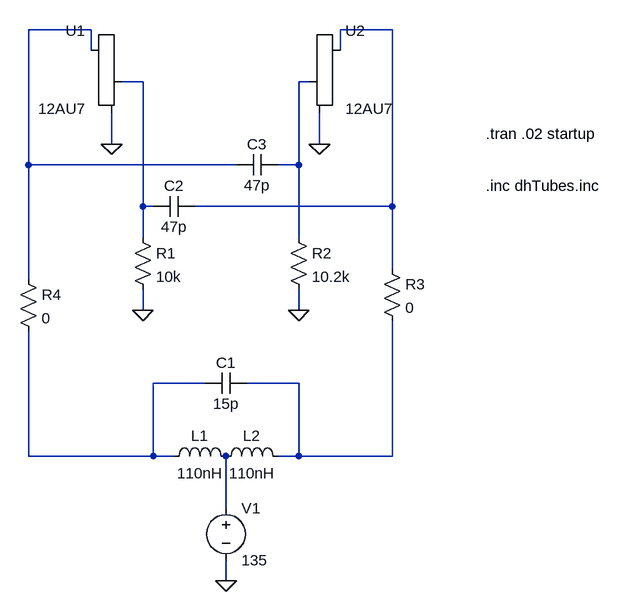
[diagram p0: schematic MesnyOscillator1.asc]
MesnyOscillator1.asc, the LTspice schematic file:
Version 4
SHEET 1 880 1012
WIRE 0 144 -96 144
WIRE 464 144 384 144
WIRE 0 176 0 144
WIRE 384 176 384 144
WIRE 80 224 48 224
WIRE 336 224 320 224
WIRE 32 320 32 272
WIRE 352 320 352 272
WIRE -96 352 -96 144
WIRE 224 352 -96 352
WIRE 320 352 320 224
WIRE 320 352 288 352
WIRE 80 416 80 224
WIRE 96 416 80 416
WIRE 464 416 464 144
WIRE 464 416 160 416
WIRE 80 464 80 416
WIRE 320 464 320 352
WIRE 464 512 464 416
WIRE -96 528 -96 352
WIRE 80 576 80 544
WIRE 320 576 320 544
WIRE 176 688 96 688
WIRE 320 688 240 688
WIRE -96 800 -96 608
WIRE 96 800 96 688
WIRE 96 800 -96 800
WIRE 128 800 96 800
WIRE 320 800 320 688
WIRE 320 800 288 800
WIRE 464 800 464 592
WIRE 464 800 320 800
WIRE 208 880 208 800
WIRE 208 992 208 960
FLAG 32 320 0
FLAG 352 320 0
FLAG 80 576 0
FLAG 320 576 0
FLAG 208 992 0
SYMBOL Misc\\triode 0 224 M0
SYMATTR InstName U1
SYMATTR Value 12AU7
SYMATTR SpiceModel 12AU7
SYMBOL Misc\\triode 384 224 R0
SYMATTR InstName U2
SYMATTR Value 12AU7
SYMATTR SpiceModel 12AU7
SYMBOL ind 112 816 R270
WINDOW 0 32 56 VTop 2
WINDOW 3 5 56 VBottom 2
SYMATTR InstName L1
SYMATTR Value 110nH
SYMBOL ind 192 816 R270
WINDOW 0 32 56 VTop 2
WINDOW 3 5 56 VBottom 2
SYMATTR InstName L2
SYMATTR Value 110nH
SYMBOL cap 240 672 R90
WINDOW 0 0 32 VBottom 2
WINDOW 3 32 32 VTop 2
SYMATTR InstName C1
SYMATTR Value 15p
SYMBOL cap 160 400 R90
WINDOW 0 0 32 VBottom 2
WINDOW 3 32 32 VTop 2
SYMATTR InstName C2
SYMATTR Value 47p
SYMBOL cap 288 336 R90
WINDOW 0 0 32 VBottom 2
WINDOW 3 32 32 VTop 2
SYMATTR InstName C3
SYMATTR Value 47p
SYMBOL res 64 448 R0
SYMATTR InstName R1
SYMATTR Value 10k
SYMBOL res 304 448 R0
SYMATTR InstName R2
SYMATTR Value 10.2k
SYMBOL voltage 208 864 R0
WINDOW 123 0 0 Left 0
WINDOW 39 0 0 Left 0
SYMATTR InstName V1
SYMATTR Value 135
SYMBOL res 448 496 R0
SYMATTR InstName R3
SYMATTR Value 0
SYMBOL res -112 512 R0
SYMATTR InstName R4
SYMATTR Value 0
TEXT 608 384 Left 2 !.inc dhTubes.inc
TEXT 608 304 Left 2 !.tran .02 startup

The netlist it stands for:
* MesnyOscillator1.asc
XU1 N001 N003 0 12AU7 12AU7
XU2 N002 N004 0 12AU7 12AU7
L1 N005 N007 110nH
L2 N007 N006 110nH
C1 N006 N005 15p
C2 N002 N003 47p
C3 N004 N001 47p
R1 N003 0 10k
R2 N004 0 10.2k
V1 N007 0 135
R3 N002 N006 0
R4 N001 N005 0
.inc dhTubes.inc
.tran .02 startup
.backanno
.end